# EAGLE design HMS_Olfactometer_v2.0 (EAGLE 9.0.1)

## Sheet 1 of 2
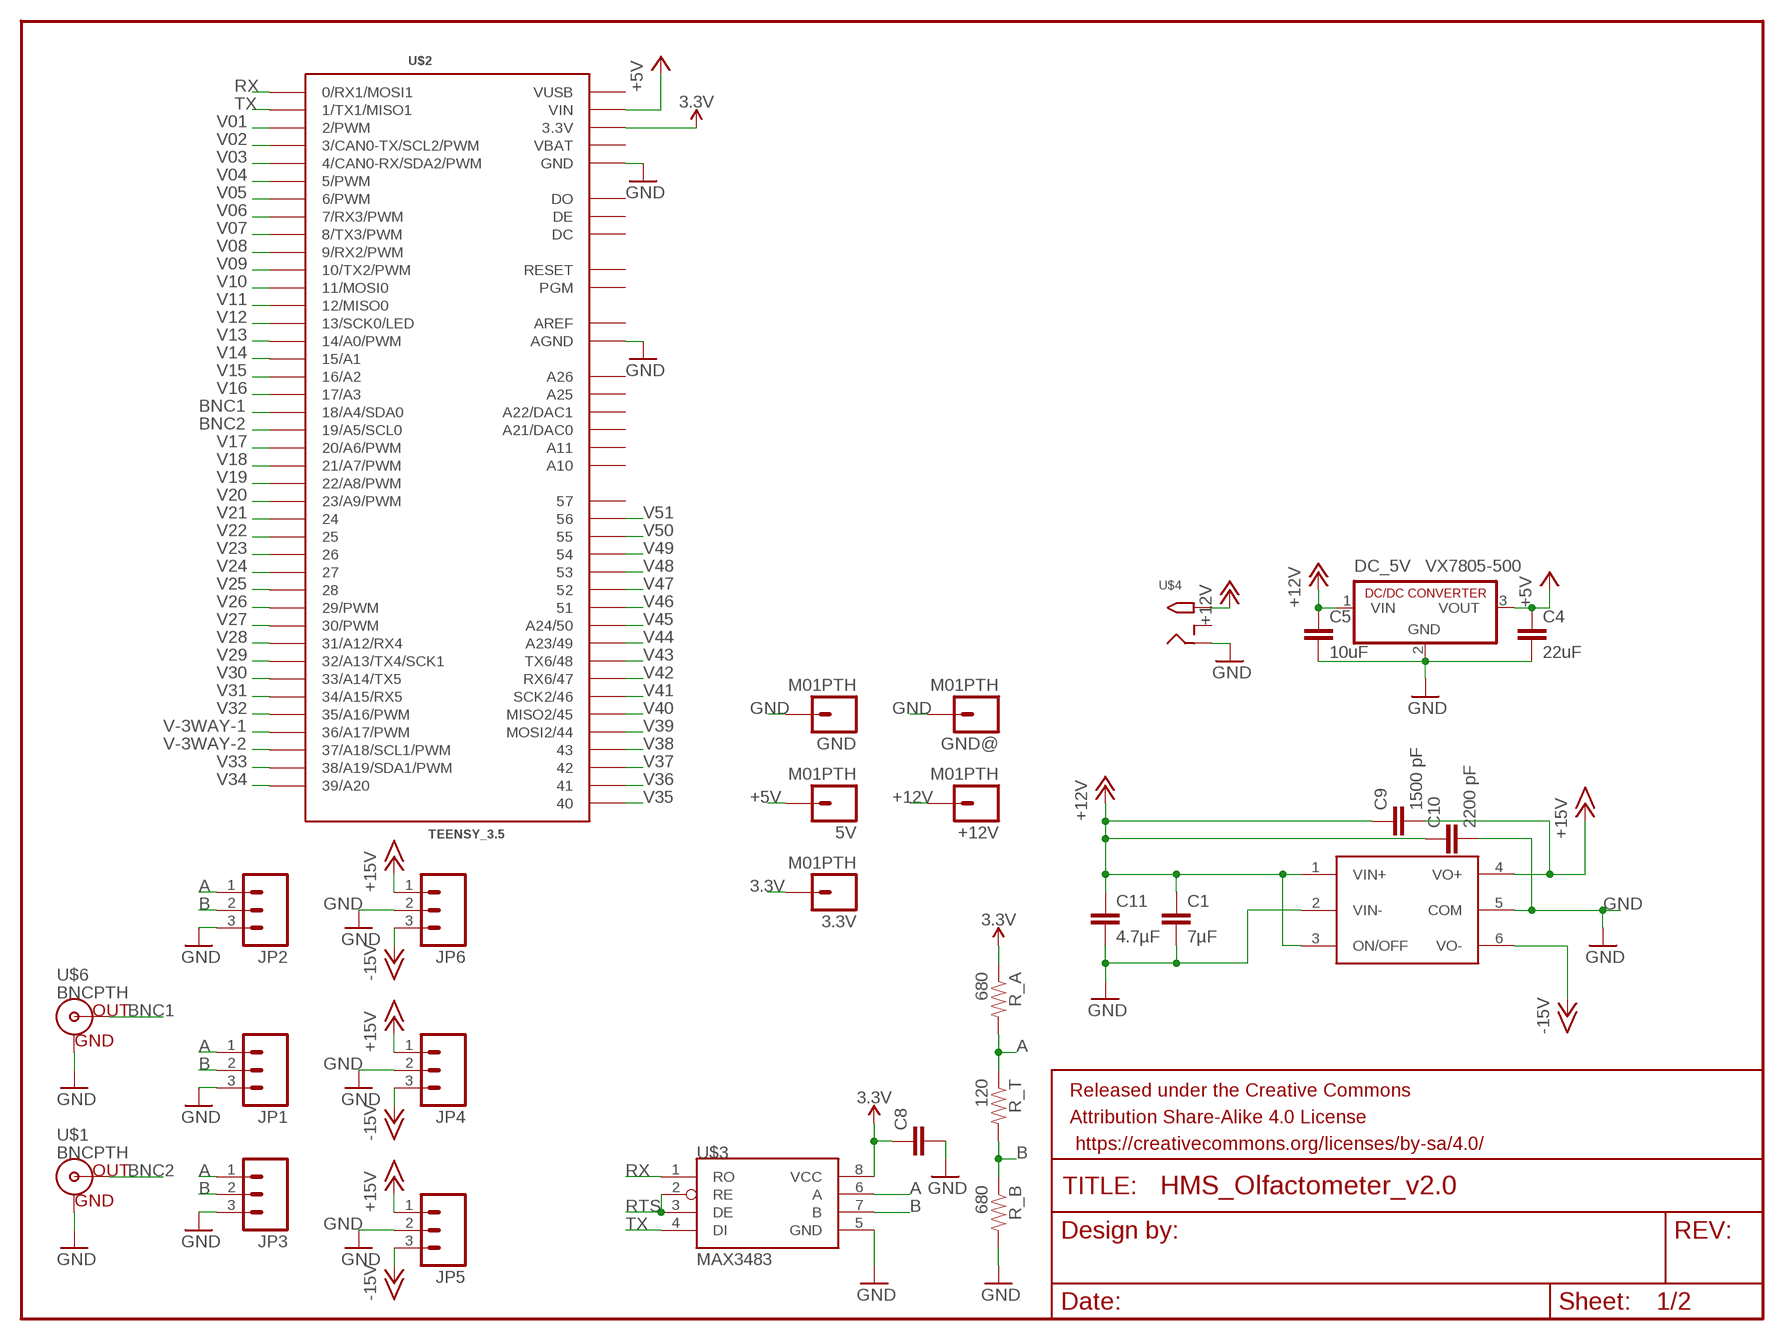
[diagram p0: schematic, sheet 1]

### Parts
3.3V  M01PTH  [1X01]
5V  M01PTH  [1X01]
+12V  M01PTH  [1X01]
C1  7µF  C-EUC1812  [C1812]
C4  22uF  10UF-6.3V-20%(1206)  [1206]
C5  10uF  CAP1206  [1206]
C8  CAP1206  [1206]
C9  1500 pF  C-EUC1206  [C1206]
C10  2200 pF  C-EUC1206  [C1206]
C11  4.7µF  C-EUC1812  [C1812]
DC_5V  VX7805-500  R-78C12-1.0  [SIP3]
DC_+/-15V  XPPOWER_+/-15V_60W_DC-DC_SUPPLY  [XPPOWER_60W_JTL60_DC_DC_POWER_SUPPLY]
FRAME1  FRAME-LETTER  [CREATIVE_COMMONS]
GND  M01PTH  [1X01]
GND@  M01PTH  [1X01]
JP1  M03POLAR  [MOLEX-1X3]
JP2  M03POLAR  [MOLEX-1X3]
JP3  M03POLAR  [MOLEX-1X3]
JP4  M03SCREW  [SCREWTERMINAL-3.5MM-3]
JP5  M03SCREW  [SCREWTERMINAL-3.5MM-3]
JP6  M03SCREW  [SCREWTERMINAL-3.5MM-3]
R_A  680  RESISTORPTH-1/2W  [AXIAL-0.5]
R_B  680  RESISTORPTH-1/2W  [AXIAL-0.5]
R_T  120  RESISTORPTH-1/2W  [AXIAL-0.5]
U$1  BNCPTH  [BNC]
U$2  TEENSY_3.5  TEENSY_3.5_ALL_PINS&PADS  [TEENSY_3.5_ALL_PINS&PADS]
U$3  MAX3483  MAX485DIL  [DIL08]
U$4  2.1MMJACKTHM  [PJ-102A]
U$6  BNCPTH  [BNC]

### Nets
3.3V [power]: 3.3V.1 C8.1 R_A.P$1 U$2.3.3V U$2.3.3V2(3.3V) U$2.3.3V3(3.3V) U$2.3.3V4(3.3V) U$3.8(VCC)
+5V [power]: 5V.1 C4.1 DC_5V.3(VOUT) U$2.VIN
+12V [power]: +12V.1 C1.1 C5.1 C9.1 C10.1 C11.1 DC_5V.1(VIN) DC_+/-15V.1(VIN+) DC_+/-15V.3(ON/OFF) U$4.TIP ; also sheet 2
+15V: C9.2 DC_+/-15V.4(VO+) JP4.1 JP5.1 JP6.1
-15V: DC_+/-15V.6(VO-) JP4.3 JP5.3 JP6.3
A: JP1.1 JP2.1 JP3.1 R_A.P$2 R_T.P$1 U$3.6(A)
B: JP1.2 JP2.2 JP3.2 R_B.P$1 R_T.P$2 U$3.7(B)
BNC1: U$2.18/A4(18/A4/SDA0) U$6.S(OUT)
BNC2: U$1.S(OUT) U$2.19/A5(19/A5/SCL0)
GND: C1.2 C4.2 C5.2 C8.2 C10.2 C11.2 DC_5V.2(GND) DC_+/-15V.2(VIN-) DC_+/-15V.5(COM) GND.1 GND@.1 JP1.3 JP2.3 JP3.3 JP4.2 JP5.2 JP6.2 R_B.P$2 U$1.GND U$2.AGND U$2.GND U$2.GND1(GND) U$2.GND2(GND) U$2.GND3(GND) U$2.GND4(GND) U$2.GND5(GND) U$2.GND6(GND) U$3.5(GND) U$4.RING U$6.GND ; also sheet 2
RTS: U$3.2(RE) U$3.3(DE)
RX: U$2.0(0/RX1/MOSI1) U$3.1(RO)
TX: U$2.1(1/TX1/MISO1) U$3.4(DI)
V01: U$2.2(2/PWM) ; also sheet 2
V02: U$2.3(3/CAN0-TX/SCL2/PWM) ; also sheet 2
V03: U$2.4(4/CAN0-RX/SDA2/PWM) ; also sheet 2
V04: U$2.5(5/PWM) ; also sheet 2
V05: U$2.6(6/PWM) ; also sheet 2
V06: U$2.7(7/RX3/PWM) ; also sheet 2
V07: U$2.8(8/TX3/PWM) ; also sheet 2
V08: U$2.9(9/RX2/PWM) ; also sheet 2
V09: U$2.10(10/TX2/PWM) ; also sheet 2
V10: U$2.11(11/MOSI0) ; also sheet 2
V11: U$2.12(12/MISO0) ; also sheet 2
V12: U$2.13(13/SCK0/LED) ; also sheet 2
V13: U$2.14/A0(14/A0/PWM) ; also sheet 2
V14: U$2.15/A1 ; also sheet 2
V15: U$2.16/A2 ; also sheet 2
V16: U$2.17/A3 ; also sheet 2
V17: U$2.20/A6(20/A6/PWM) ; also sheet 2
V18: U$2.21/A7(21/A7/PWM) ; also sheet 2
V19: U$2.22/A8(22/A8/PWM) ; also sheet 2
V20: U$2.23/A9(23/A9/PWM) ; also sheet 2
V21: U$2.24 ; also sheet 2
V22: U$2.25 ; also sheet 2
V23: U$2.26 ; also sheet 2
V24: U$2.27 ; also sheet 2
V25: U$2.28 ; also sheet 2
V26: U$2.29(29/PWM) ; also sheet 2
V27: U$2.30(30/PWM) ; also sheet 2
V28: U$2.31/A12(31/A12/RX4) ; also sheet 2
V29: U$2.32/A13(32/A13/TX4/SCK1) ; also sheet 2
V30: U$2.33/A14(33/A14/TX5) ; also sheet 2
V31: U$2.34/A15(34/A15/RX5) ; also sheet 2
V32: U$2.35/A16(35/A16/PWM) ; also sheet 2
V33: U$2.38/A19(38/A19/SDA1/PWM) ; also sheet 2
V34: U$2.39/A20 ; also sheet 2
V35: U$2.40 ; also sheet 2
V36: U$2.41 ; also sheet 2
V37: U$2.42 ; also sheet 2
V38: U$2.43 ; also sheet 2
V39: U$2.44(MOSI2/44) ; also sheet 2
V40: U$2.45(MISO2/45) ; also sheet 2
V41: U$2.46(SCK2/46) ; also sheet 2
V42: U$2.47(RX6/47) ; also sheet 2
V43: U$2.48(TX6/48) ; also sheet 2
V44: U$2.49(A23/49) ; also sheet 2
V45: U$2.50(A24/50) ; also sheet 2
V46: U$2.51 ; also sheet 2
V47: U$2.52 ; also sheet 2
V48: U$2.53 ; also sheet 2
V49: U$2.54 ; also sheet 2
V50: U$2.55 ; also sheet 2
V51: U$2.56 ; also sheet 2
V-3WAY-1: U$2.36/A17(36/A17/PWM) ; also sheet 2
V-3WAY-2: U$2.37/A18(37/A18/SCL1/PWM) ; also sheet 2
Unconnected: U$2.57 U$2.A10 U$2.A11 U$2.A21(A21/DAC0) U$2.A22(A22/DAC1) U$2.A25 U$2.A26 U$2.DC U$2.DE U$2.DO U$2.PGM U$2.RESET U$4.RING_SW

## Sheet 2 of 2
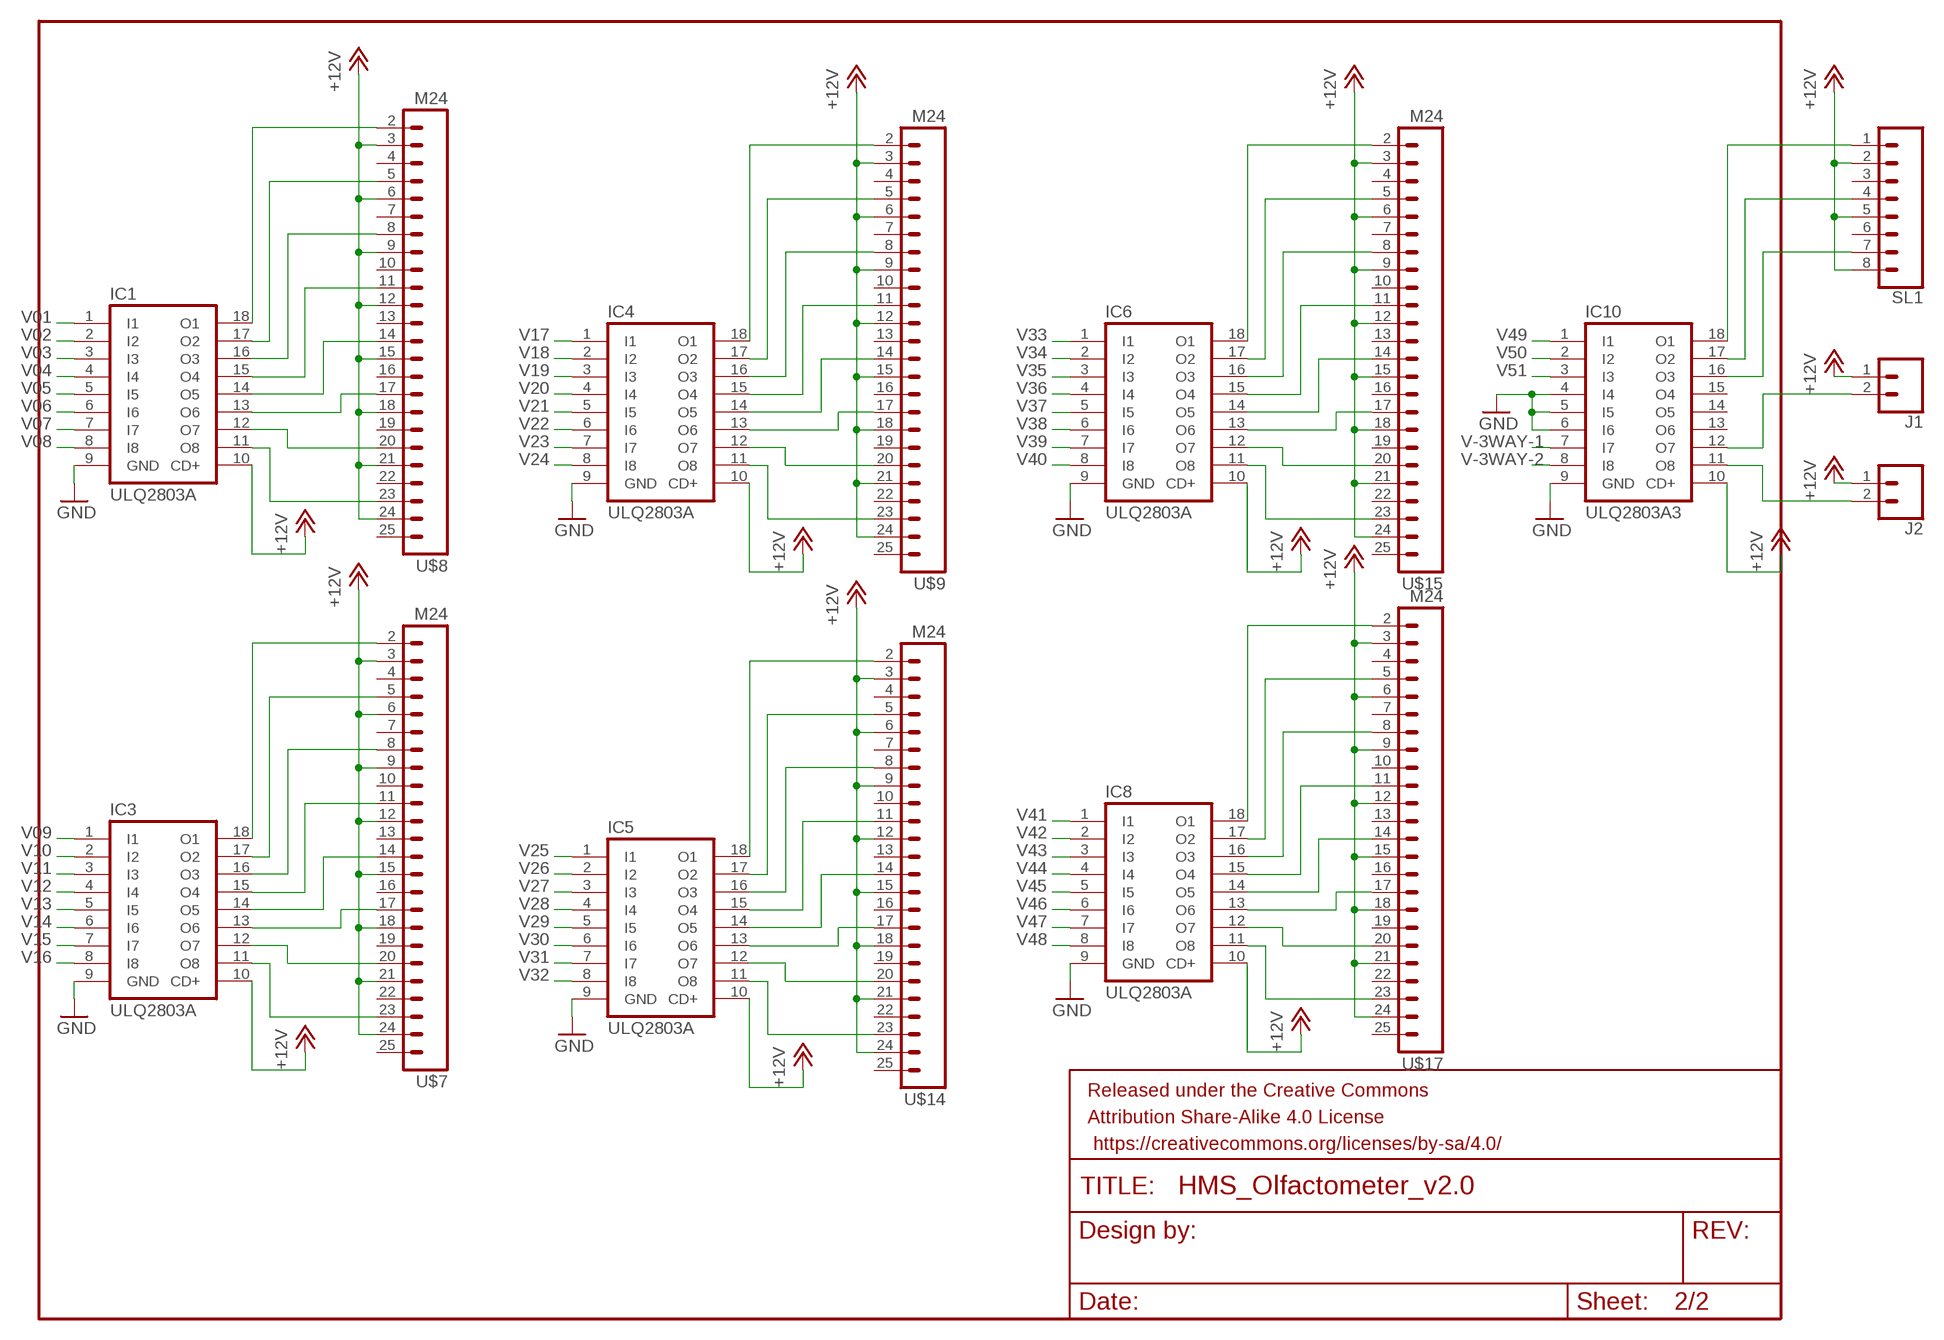
[diagram p1: schematic, sheet 2]

### Parts
FRAME2  FRAME-LETTER  [CREATIVE_COMMONS]
IC1  ULQ2803A  ULN2803A  [DIL18]
IC3  ULQ2803A  ULN2803A  [DIL18]
IC4  ULQ2803A  ULN2803A  [DIL18]
IC5  ULQ2803A  ULN2803A  [DIL18]
IC6  ULQ2803A  ULN2803A  [DIL18]
IC8  ULQ2803A  ULN2803A  [DIL18]
IC10  ULQ2803A3  ULN2803A  [DIL18]
J1  CONN_02  [1X02]
J2  CONN_02  [1X02]
SL1  CONN_08"  [1X08]
U$7  M24  [1X24]
U$8  M24  [1X24]
U$9  M24  [1X24]
U$14  M24  [1X24]
U$15  M24  [1X24]
U$17  M24  [1X24]

### Nets
+12V [power]: IC1.10(CD+) IC3.10(CD+) IC4.10(CD+) IC5.10(CD+) IC6.10(CD+) IC8.10(CD+) IC10.10(CD+) J1.1 J2.1 SL1.2 SL1.5 SL1.8 U$7.3 U$7.6 U$7.9 U$7.12 U$7.15 U$7.18 U$7.21 U$7.24 U$8.3 U$8.6 U$8.9 U$8.12 U$8.15 U$8.18 U$8.21 U$8.24 U$9.3 U$9.6 U$9.9 U$9.12 U$9.15 U$9.18 U$9.21 U$9.24 U$14.3 U$14.6 U$14.9 U$14.12 U$14.15 U$14.18 U$14.21 U$14.24 U$15.3 U$15.6 U$15.9 U$15.12 U$15.15 U$15.18 U$15.21 U$15.24 U$17.3 U$17.6 U$17.9 U$17.12 U$17.15 U$17.18 U$17.21 U$17.24 ; also sheet 1
GND: IC1.9(GND) IC3.9(GND) IC4.9(GND) IC5.9(GND) IC6.9(GND) IC8.9(GND) IC10.4(I4) IC10.5(I5) IC10.6(I6) IC10.9(GND) ; also sheet 1
N$2: IC1.18(O1) U$8.2
N$3: IC1.17(O2) U$8.5
N$4: IC1.16(O3) U$8.8
N$5: IC1.15(O4) U$8.11
N$6: IC1.14(O5) U$8.14
N$7: IC1.13(O6) U$8.17
N$8: IC1.12(O7) U$8.20
N$9: IC1.11(O8) U$8.23
N$17: IC3.11(O8) U$7.23
N$18: IC3.12(O7) U$7.20
N$19: IC3.13(O6) U$7.17
N$20: IC3.14(O5) U$7.14
N$21: IC3.15(O4) U$7.11
N$22: IC3.16(O3) U$7.8
N$23: IC3.17(O2) U$7.5
N$24: IC3.18(O1) U$7.2
N$25: IC4.11(O8) U$9.23
N$26: IC4.12(O7) U$9.20
N$27: IC4.13(O6) U$9.17
N$28: IC4.14(O5) U$9.14
N$29: IC4.15(O4) U$9.11
N$30: IC4.16(O3) U$9.8
N$31: IC4.17(O2) U$9.5
N$32: IC4.18(O1) U$9.2
N$33: IC5.11(O8) U$14.23
N$34: IC5.12(O7) U$14.20
N$35: IC5.13(O6) U$14.17
N$36: IC5.14(O5) U$14.14
N$37: IC5.15(O4) U$14.11
N$38: IC5.16(O3) U$14.8
N$39: IC5.17(O2) U$14.5
N$40: IC5.18(O1) U$14.2
N$51: IC6.11(O8) U$15.23
N$52: IC6.12(O7) U$15.20
N$61: IC6.13(O6) U$15.17
N$63: IC6.14(O5) U$15.14
N$64: IC6.15(O4) U$15.11
N$65: IC6.16(O3) U$15.8
N$66: IC6.17(O2) U$15.5
N$67: IC6.18(O1) U$15.2
N$76: IC8.11(O8) U$17.23
N$77: IC8.12(O7) U$17.20
N$78: IC8.13(O6) U$17.17
N$79: IC8.14(O5) U$17.14
N$80: IC8.15(O4) U$17.11
N$81: IC8.16(O3) U$17.8
N$82: IC8.17(O2) U$17.5
N$83: IC8.18(O1) U$17.2
N$92: IC10.11(O8) J2.2
N$93: IC10.12(O7) J1.2
N$97: IC10.16(O3) SL1.7
N$98: IC10.17(O2) SL1.4
N$99: IC10.18(O1) SL1.1
V01: IC1.1(I1) ; also sheet 1
V02: IC1.2(I2) ; also sheet 1
V03: IC1.3(I3) ; also sheet 1
V04: IC1.4(I4) ; also sheet 1
V05: IC1.5(I5) ; also sheet 1
V06: IC1.6(I6) ; also sheet 1
V07: IC1.7(I7) ; also sheet 1
V08: IC1.8(I8) ; also sheet 1
V09: IC3.1(I1) ; also sheet 1
V10: IC3.2(I2) ; also sheet 1
V11: IC3.3(I3) ; also sheet 1
V12: IC3.4(I4) ; also sheet 1
V13: IC3.5(I5) ; also sheet 1
V14: IC3.6(I6) ; also sheet 1
V15: IC3.7(I7) ; also sheet 1
V16: IC3.8(I8) ; also sheet 1
V17: IC4.1(I1) ; also sheet 1
V18: IC4.2(I2) ; also sheet 1
V19: IC4.3(I3) ; also sheet 1
V20: IC4.4(I4) ; also sheet 1
V21: IC4.5(I5) ; also sheet 1
V22: IC4.6(I6) ; also sheet 1
V23: IC4.7(I7) ; also sheet 1
V24: IC4.8(I8) ; also sheet 1
V25: IC5.1(I1) ; also sheet 1
V26: IC5.2(I2) ; also sheet 1
V27: IC5.3(I3) ; also sheet 1
V28: IC5.4(I4) ; also sheet 1
V29: IC5.5(I5) ; also sheet 1
V30: IC5.6(I6) ; also sheet 1
V31: IC5.7(I7) ; also sheet 1
V32: IC5.8(I8) ; also sheet 1
V33: IC6.1(I1) ; also sheet 1
V34: IC6.2(I2) ; also sheet 1
V35: IC6.3(I3) ; also sheet 1
V36: IC6.4(I4) ; also sheet 1
V37: IC6.5(I5) ; also sheet 1
V38: IC6.6(I6) ; also sheet 1
V39: IC6.7(I7) ; also sheet 1
V40: IC6.8(I8) ; also sheet 1
V41: IC8.1(I1) ; also sheet 1
V42: IC8.2(I2) ; also sheet 1
V43: IC8.3(I3) ; also sheet 1
V44: IC8.4(I4) ; also sheet 1
V45: IC8.5(I5) ; also sheet 1
V46: IC8.6(I6) ; also sheet 1
V47: IC8.7(I7) ; also sheet 1
V48: IC8.8(I8) ; also sheet 1
V49: IC10.1(I1) ; also sheet 1
V50: IC10.2(I2) ; also sheet 1
V51: IC10.3(I3) ; also sheet 1
V-3WAY-1: IC10.7(I7) ; also sheet 1
V-3WAY-2: IC10.8(I8) ; also sheet 1
Unconnected: IC10.13(O6) IC10.14(O5) IC10.15(O4) SL1.3 SL1.6 U$7.4 U$7.7 U$7.10 U$7.13 U$7.16 U$7.19 U$7.22 U$7.25 U$8.4 U$8.7 U$8.10 U$8.13 U$8.16 U$8.19 U$8.22 U$8.25 U$9.4 U$9.7 U$9.10 U$9.13 U$9.16 U$9.19 U$9.22 U$9.25 U$14.4 U$14.7 U$14.10 U$14.13 U$14.16 U$14.19 U$14.22 U$14.25 U$15.4 U$15.7 U$15.10 U$15.13 U$15.16 U$15.19 U$15.22 U$15.25 U$17.4 U$17.7 U$17.10 U$17.13 U$17.16 U$17.19 U$17.22 U$17.25

## Power pins joined to a net without a drawn wire
AREF: U$2.AREF
VBAT: U$2.VBAT
VUSB: U$2.VUSB

## Library data of the parts
3.3V 5V +12V GND GND@ = SparkFun-Connectors:M01: Header 1 Standard 1-pin 0.1" header. Use with straight break away headers (SKU : PRT-00116), right angle break away headers (PRT-00553), swiss pins (PRT-00743), machine pins (PRT-00117), and female headers (PRT-00115).
C1 C9-C11 = rcl:C-EU: CAPACITOR, European symbol; SPICEPREFIX: C
C4 = SparkFun-Capacitors:10UF-6.3V-20%(1206): Ceramic CAP-10057; PROD_ID: CAP-10057; VALUE: 10uF
C5 C8 = SparkFun-Capacitors:CAP: Capacitor Standard 0603 ceramic capacitor, and 0.1" leaded capacitor.
DC_5V = dc-dc-converter:R-78C*-1.0: INNOLINE DC/DC-Converter 1.0 AMP SIP3 Single Output Source: Data sheet <http://www.mikrocontroller.net/attachment/150645/157764-da-01-en-DC_DC_WANDLER_R_78C5_0_1_0.pdf>
DC_+/-15V = ofer-eagle-lib:XPPOWER_+/-15V_60W_DC-DC_SUPPLY
FRAME1 FRAME2 = SparkFun-Aesthetics:FRAME-LETTER: Schematic Frame - Letter Standard 8.5x11 US Letter frame
IC1 IC3-IC6 IC8 IC10 = uln-udn:ULN2803A: DRIVER ARRAY
J1 J2 = SparkFun-Connectors:CONN_02: Multi connection point. Often used as Generic Header-pin footprint for 0.1 inch spaced/style header connections On any of the 0.1 inch spaced packages, you can populate with these: Break Away Headers - Straight <https://www.sparkfun.com/products/116> (PRT-00116) Break Away Male Headers - Right Angle <https://www.sparkfun.com/products/553> (PRT-00553) Female Headers <https://www.sparkfun.com/products/115> (PRT-00115) Break Away Headers - Machine Pin <https://www.sparkfun.com/products/117> (PRT-00117) Break Away Female Headers - Swiss Machine Pin <https://www.sparkfun.com/products/743> (PRT-00743) For SCREWTERMINALS and SPRING TERMINALS visit here: Screw Terimnals on SparkFun.com <https://www.sparkfun.com/search/results?term=Screw+Terminals> (5mm/3.5mm/2.54mm spacing) This device is also useful as a general connection point to wire up your design to another part of your project. Our various solder wires solder well into these plated through hole pads. Hook-Up Wire - Assortment (Stranded, 22 AWG) <https://www.sparkfun.com/products/11375> (PRT-11375) Hook-Up Wire - Assortment (Solid Core, 22 AWG) <https://www.sparkfun.com/products/11367> (PRT-11367) View the entire wire category on our website here <https://www.sparkfun.com/categories/141> Special notes: Molex polarized connector foot print use with: PRT-08233 with associated crimp pins and housings. 2.54_SCREWTERM for use with PRT-10571. 3.5mm Screw Terminal footprints for PRT-08084 5mm Screw Terminal footprints for use with PRT-08432
JP1-JP6 = SparkFun-Connectors:M03: Header 3 Standard 3-pin 0.1" header. Use with straight break away headers (SKU : PRT-00116), right angle break away headers (PRT-00553), swiss pins (PRT-00743), machine pins (PRT-00117), and female headers (PRT-00115). Molex polarized connector foot print use with SKU : PRT-08232 with associated crimp pins and housings.
R_A R_B R_T = SparkFun-Resistors:RESISTOR: Resistor Basic schematic elements and footprints for 0603, 1206, and PTH resistors.
SL1 = SparkFun-Connectors:CONN_08: Multi connection point. Often used as Generic Header-pin footprint for 0.1 inch spaced/style header connections On any of the 0.1 inch spaced packages, you can populate with these: Break Away Headers - Straight <https://www.sparkfun.com/products/116> (PRT-00116) Break Away Male Headers - Right Angle <https://www.sparkfun.com/products/553> (PRT-00553) Female Headers <https://www.sparkfun.com/products/115> (PRT-00115) Break Away Headers - Machine Pin <https://www.sparkfun.com/products/117> (PRT-00117) Break Away Female Headers - Swiss Machine Pin <https://www.sparkfun.com/products/743> (PRT-00743) Arduino Stackable Header - 8 Pin <https://www.sparkfun.com/products/9279> (PRT-09279) For SCREWTERMINALS and SPRING TERMINALS visit here: Screw Terimnals on SparkFun.com <https://www.sparkfun.com/search/results?term=Screw+Terminals> (5mm/3.5mm/2.54mm spacing) This device is also useful as a general connection point to wire up your design to another part of your project. Our various solder wires solder well into these plated through hole pads. Hook-Up Wire - Assortment (Stranded, 22 AWG) <https://www.sparkfun.com/products/11375> (PRT-11375) Hook-Up Wire - Assortment (Solid Core, 22 AWG) <https://www.sparkfun.com/products/11367> (PRT-11367) View the entire wire category on our website here <https://www.sparkfun.com/categories/141> Special notes: Molex polarized connector foot print use with SKU : PRT-08231 with associated crimp pins and housings. 1MM SMD Version SKU: PRT-10208 NOTES ON THE VARIANTS LOCK and LOCK_LONGPADS... This footprint was designed to help hold the alignment of a through-hole component (i.e. 6-pin header) while soldering it into place. You may notice that each hole has been shifted either up or down by 0.005 of an inch from it's more standard position (which is a perfectly straight line). This slight alteration caused the pins (the squares in the middle) to touch the edges of the holes. Because they are alternating, it causes a "brace" to hold the component in place. 0.005 has proven to be the perfect amount of "off-center" position when using our standard breakaway headers. Although looks a little odd when you look at the bare footprint, once you have a header in there, the alteration is very hard to notice. Also,if you push a header all the way into place, it is covered up entirely on the bottom side.; PROD_ID: CONN-08438
U$1 U$6 = SparkFun-Connectors:BNC: BNC Connector, Mouser Part# 5227161
U$2 = Teensy_3_and_LC_Series_Boards_v1.4:TEENSY_3.5_ALL_PINS&PADS: All pins and pads on the Teensy 3.5 exposed. Assumes the use of multiple, unshrouded headers to get access to the pads on the underside of the Teensy These headers should be a 2x5, 2x4, and a 2x3 with a 0.1" hole spacing / pitch.
U$3 = SparkFun-DigitalIC:MAX485: RS-485 transceiver; SPICEPREFIX: X
U$4 = adafruit:2.1MMJACK: 2.1mm x 5.5mm THM DC jack with internal switch. Digikey part #PJ-102A, 4UCON part #05537 2.1mm x 5.5mm SMT DC jack with internal switch. Digikey part #PJ-002A-SMT, 4UCON part #03267 By microbuilder.eu & adafruit.com
U$7-U$9 U$14 U$15 U$17 = SparkFun-Connectors:M24: 1x24 .1" header

## Net classes
0 default: width 0.203 mm, clearance 0.203 mm
1 power: width 0.61 mm, clearance 0.254 mm

## Board
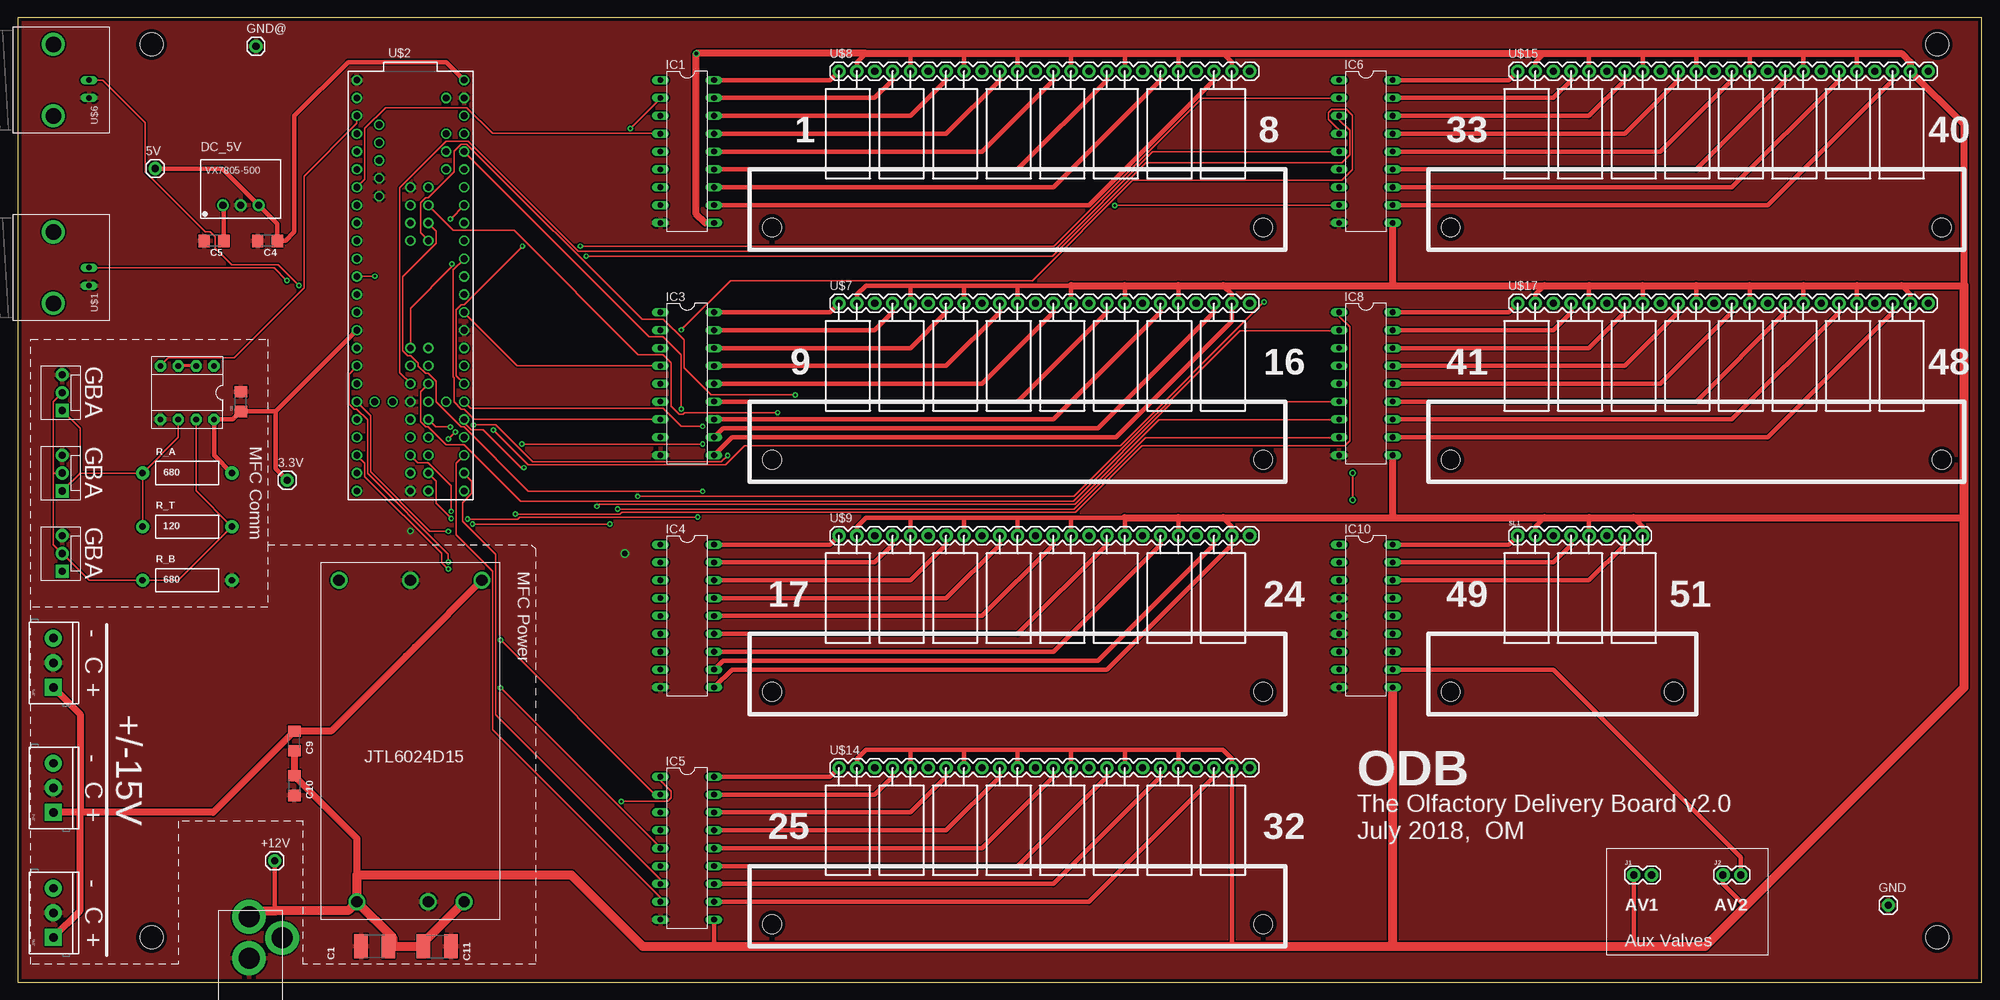
[diagram p2: board, top side]
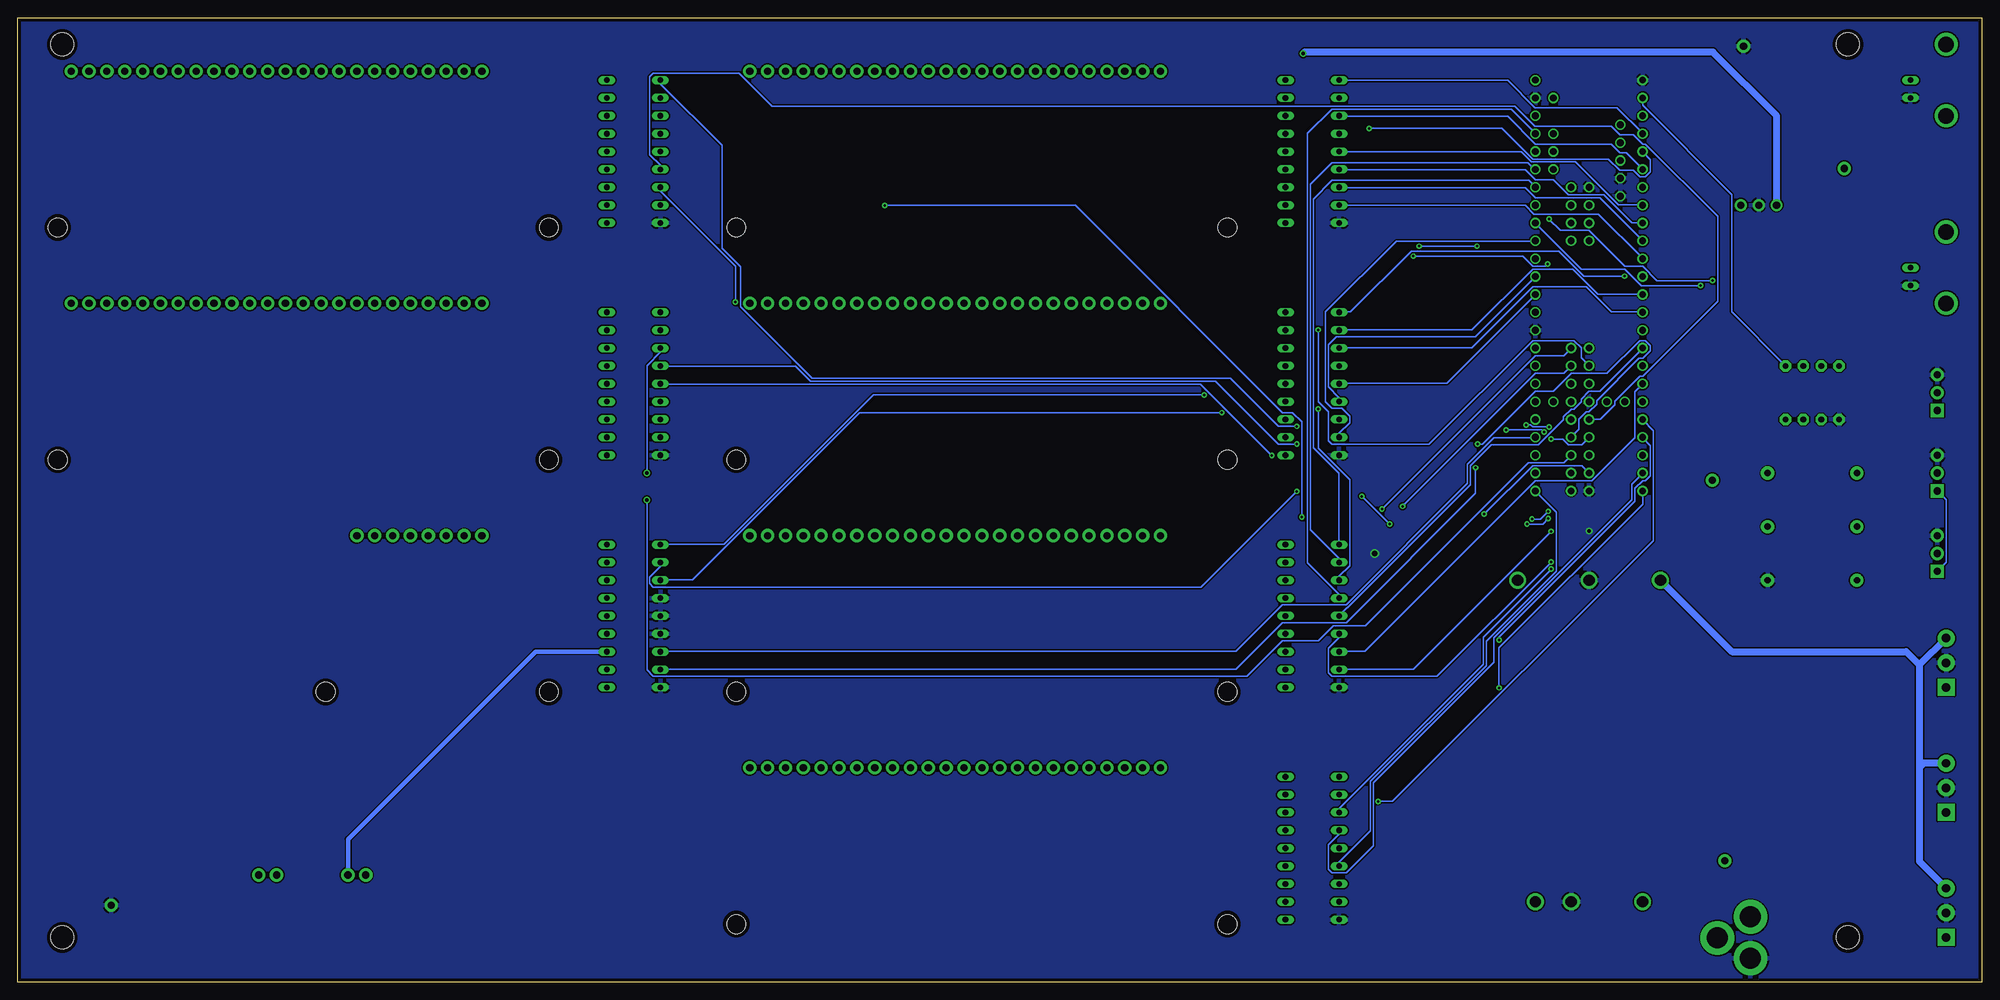
[diagram p3: board, bottom side, seen from below]

Size 279.4 x 137.16 mm. Coordinates in mm from the lower left corner, seen from the top.
Outline: 0,0 279.4,0 279.4,137.16 0,137.16 0,0
Copper layers (1*16): Top 0.0178mm / dielectric 59mil / Bottom 0.0178mm
Design rules "SSC-EAGLE-2Lyr_v1.0.0.3 *": minimum track width 6mil, minimum drill 14mil, track to track 6mil, track to pad 6mil, pad to pad 6mil, via to via 6mil, smd to smd 6mil, copper to edge 20mil, drill to drill 16mil, minimum pad ring 8mil, minimum via ring 8mil, stop-mask expansion 3mil, vias tented up to drill 0mil, thermal gap 10mil
Holes 2.72 mm at 177.16,107.31 107.31,107.31 177.16,74.3 107.31,74.3 177.16,41.27 107.31,41.27 177.16,8.26 107.31,8.26 273.69,107.31 203.84,107.31 273.69,74.3 203.84,74.3 235.59,41.27 203.84,41.27

### Footprints (pad centres in the part's own frame; a part is rotated, then mirrored left to right if it is on the bottom)
1X01 = drill 1.016 pad 1.88: 1 0,0
C1812 = smd 1.9 x 3.4: 1 -1.95,0; 2 1.95,0
1206 = smd 1.6 x 1.8: 1 -1.4,0; 2 1.4,0
C1206 = smd 1.6 x 1.8: 1 -1.4,0; 2 1.4,0
SIP3 = drill 1 pad 1.676: 1 -2.54,0; 2 0,0; 3 2.54,0
XPPOWER_60W_JTL60_DC_DC_POWER_SUPPLY = drill 1.6: 1 -22.86,-7.62; 2 -22.86,-2.54; 3 -22.86,7.62; 4 22.86,-10.16; 5 22.86,0; 6 22.86,10.16
DIL18 = drill 0.813 long: 1 -10.16,-3.81; 2 -7.62,-3.81; 3 -5.08,-3.81; 4 -2.54,-3.81; 5 0,-3.81; 6 2.54,-3.81; 7 5.08,-3.81; 8 7.62,-3.81; 9 10.16,-3.81; 10 10.16,3.81; 11 7.62,3.81; 12 5.08,3.81; 13 2.54,3.81; 14 0,3.81; 15 -2.54,3.81; 16 -5.08,3.81; 17 -7.62,3.81; 18 -10.16,3.81
1X02 = drill 1.016 pad 1.88: 1 0,0; 2 2.54,0
MOLEX-1X3 = drill 1.016 pad 1.88 square: 1 0,0 | drill 1.016 pad 1.88: 2 2.54,0; 3 5.08,0
SCREWTERMINAL-3.5MM-3 = drill 1.2 pad 2.413 square: 1 0,0 | drill 1.2 pad 2.413: 2 3.5,0; 3 7,0
AXIAL-0.5 = drill 0.9 pad 1.88: P$1 -6.35,0; P$2 6.35,0
1X08 = drill 1.016 pad 1.88: 1 0,0; 2 2.54,0; 3 5.08,0; 4 7.62,0; 5 10.16,0; 6 12.7,0; 7 15.24,0; 8 17.78,0
BNC = drill 2.2: 3 -5.08,5.08; 4 5.08,5.08 | drill 0.8 long: GND -2.54,0; S 0,0
TEENSY_3.5_ALL_PINS&PADS = drill 0.965: 0 -7.62,13.97; 1 -7.62,11.43; 2 -7.62,8.89; 3 -7.62,6.35; 3.3V 7.62,11.43; 3.3V2 2.54,-41.91; 3.3V3 -7.62,-19.05; 3.3V4 -2.54,-29.21; 4 -7.62,3.81; 5 -7.62,1.27; 6 -7.62,-1.27; 7 -7.62,-3.81; 8 -7.62,-6.35; 9 -7.62,-8.89; 10 -7.62,-11.43; 11 -7.62,-13.97; 12 -7.62,-16.51; 13 7.62,-16.51; 14/A0 7.62,-13.97; 15/A1 7.62,-11.43; 16/A2 7.62,-8.89; 17/A3 7.62,-6.35; 18/A4 7.62,-3.81; 19/A5 7.62,-1.27; 20/A6 7.62,1.27; 21/A7 7.62,3.81; 22/A8 7.62,6.35; 23/A9 7.62,8.89; 24 -7.62,-21.59; 25 -7.62,-24.13; 26 -7.62,-26.67; 27 -7.62,-29.21; 28 -7.62,-31.75; 29 -7.62,-34.29; 30 -7.62,-36.83; 31/A12 -7.62,-39.37; 32/A13 -7.62,-41.91; 33/A14 7.62,-41.91; 34/A15 7.62,-39.37; 35/A16 7.62,-36.83; 36/A17 7.62,-34.29; 37/A18 7.62,-31.75; 38/A19 7.62,-29.21; 39/A20 7.62,-26.67; 40 0,-21.59; 41 0,-24.13; 42 0,-26.67; 43 0,-31.75; 44 0,-34.29; 45 0,-36.83; 46 0,-39.37; 47 2.54,-39.37; 48 2.54,-36.83; 49 2.54,-34.29; 50 2.54,-31.75; 51 2.54,-26.67; 52 2.54,-24.13; 53 2.54,-21.59; 54 2.54,-6.35; 55 2.54,-3.81; 56 2.54,-1.27; 57 2.54,1.27; A10 5.08,6.35; A11 5.08,3.81; A21 7.62,-24.13; A22 7.62,-21.59; A25 -4.445,5.08; A26 -4.445,7.62; AGND 7.62,13.97; AREF 5.08,8.89; DC 0,-3.81; DE 0,-1.27; DO 0,-6.35; GND -7.62,16.51; GND1 7.62,-19.05; GND2 0,1.27; GND3 -4.445,2.54; GND4 -4.445,0; GND5 0,-41.91; GND6 0,-29.21; NC -4.445,10.16; PGM 2.54,-29.21; RESET 5.08,-29.21; VBAT -5.08,-29.21; VIN 7.62,16.51; VUSB 5.08,13.97
DIL08 = drill 0.813 pad 1.6 octagon: 1 -3.81,-3.81; 2 -1.27,-3.81; 3 1.27,-3.81; 4 3.81,-3.81; 5 3.81,3.81; 6 1.27,3.81; 7 -1.27,3.81; 8 -3.81,3.81
PJ-102A = drill 3 pad 4.8: RING 0.1,-3.39; RING_SW -4.6,-6.29; TIP 0.1,-9.29
1X24 = drill 1.016 pad 1.88: 2 -26.67,0; 3 -24.13,0; 4 -21.59,0; 5 -19.05,0; 6 -16.51,0; 7 -13.97,0; 8 -11.43,0; 9 -8.89,0; 10 -6.35,0; 11 -3.81,0; 12 -1.27,0; 13 1.27,0; 14 3.81,0; 15 6.35,0; 16 8.89,0; 17 11.43,0; 18 13.97,0; 19 16.51,0; 20 19.05,0; 21 21.59,0; 22 24.13,0; 23 26.67,0; 24 29.21,0; 25 31.75,0
STAND-OFF = hole 3.302: 0,0

### Placement (x,y rotation side)
3.3V  38.35,71.37 0 top
5V  19.56,115.7 0 top
+12V  36.58,17.27 0 top
C1  50.8,5.08 180 top
C4  35.56,105.41 180 top
C5  27.94,105.41 180 top
C8  31.75,82.55 90 top
C9  39.37,34.29 90 top
C10  39.37,27.94 270 top
C11  59.69,5.08 0 top
DC_5V  31.75,110.49 0 top
DC_+/-15V  55.88,34.29 90 top
FRAME1  22.61,-11.94 0 top  (outside the outline)
FRAME2  22.61,-11.81 0 top  (outside the outline)
GND  266.06,10.92 0 top
GND@  33.91,133.1 0 top
IC1  95.25,118.11 270 top
IC3  95.25,85.09 270 top
IC4  95.25,52.07 270 top
IC5  95.25,19.05 270 top
IC6  191.77,118.11 270 top
IC8  191.77,85.09 270 top
IC10  191.77,52.07 270 top
J1  229.87,15.24 0 top
J2  242.57,15.24 0 top
JP1  6.35,69.85 90 top
JP2  6.35,81.28 90 top
JP3  6.35,58.42 90 top
JP4  5.08,24.13 90 top
JP5  5.08,41.91 90 top
JP6  5.08,6.35 90 top
R_A  24.13,72.39 180 top
R_B  24.13,57.15 0 top
R_T  24.13,64.77 0 top
SL1  213.36,63.5 0 top
U$1  10.16,101.6 90 top
U$2  55.88,111.76 0 top
U$3  24.13,83.82 180 top
U$4  33.02,0 180 top
U$6  10.16,128.27 90 top
U$7  143.51,96.52 0 top
U$8  143.51,129.54 0 top
U$9  143.51,63.5 0 top
U$10  [STAND-OFF]  19.05,6.35 0 top
U$11  [STAND-OFF]  19.05,133.35 0 top
U$12  [STAND-OFF]  273.05,133.35 0 top
U$13  [STAND-OFF]  273.05,6.35 0 top
U$14  143.51,30.48 0 top
U$15  240.03,129.54 0 top
U$17  240.03,96.52 0 top

### Tracks (layer width: path | path; a pad name or v marks a point on that pad's centre or on a via)
3.3V
  Top 0.61: R_A.P$1 27.94,74.93 U$3.8 30.61,80.01 C8.1 36.7,81.15 | 36.7,81.15 U$2.3.3V3 | 3.3V.1 36.7,73.03 36.7,81.15
+5V
  Top 0.61: U$2.VIN 60.96,130.81 46.99,130.81 39.37,123.19 39.37,106.68 38.1,105.41 C4.1 36.96,107.82 DC_5V.3 29.08,115.7 5V.1
+12V  (via drill 0.51)
  Top 0.61: U$8.24 172.72,130.81 171.45,132.08 165.1,132.08 | 165.1,132.08 157.48,132.08 | 157.48,132.08 149.86,132.08 | 149.86,132.08 142.24,132.08 | 142.24,132.08 134.62,132.08 | 134.62,132.08 127,132.08 | 127,132.08 120.65,132.08 119.38,130.81 U$8.3 | 127,132.08 U$8.6 | 134.62,132.08 U$8.9 | 142.24,132.08 U$8.12 | U$8.15 149.86,132.08 | U$8.18 157.48,132.08 | U$8.21 165.1,132.08 | U$15.3 215.9,130.81 217.17,132.08 223.52,132.08 | 223.52,132.08 231.14,132.08 | 231.14,132.08 238.76,132.08 | 238.76,132.08 246.38,132.08 | 246.38,132.08 254,132.08 | 254,132.08 261.62,132.08 | 261.62,132.08 267.97,132.08 | U$15.21 261.62,132.08 | U$15.18 254,132.08 | U$15.15 246.38,132.08 | U$15.12 238.76,132.08 | U$15.9 231.14,132.08 | U$15.6 223.52,132.08 | U$17.3 215.9,97.79 217.17,99.06 | 267.97,99.06 269.24,97.79 U$17.24 | U$17.21 261.62,99.06 | U$17.18 254,99.06 | U$17.15 246.38,99.06 | U$17.12 238.76,99.06 | U$17.9 231.14,99.06 | U$17.6 223.52,99.06 | SL1.2 215.9,64.77 217.17,66.04 | 229.87,66.04 231.14,64.77 SL1.8 | SL1.5 223.52,66.04 | U$9.3 119.38,64.77 120.65,66.04 127,66.04 | 127,66.04 134.62,66.04 | 134.62,66.04 142.24,66.04 | 142.24,66.04 149.86,66.04 | 149.86,66.04 157.48,66.04 U$9.18 | 171.45,66.04 172.72,64.77 U$9.24 172.72,62.23 154.94,44.45 101.6,44.45 IC4.10 | U$9.21 165.1,66.04 | U$9.15 149.86,66.04 | U$9.12 142.24,66.04 | U$9.9 134.62,66.04 | U$9.6 127,66.04 | U$7.3 119.38,97.79 120.65,99.06 127,99.06 | 127,99.06 134.62,99.06 | 134.62,99.06 142.24,99.06 | 142.24,99.06 149.86,99.06 U$7.15 | 171.45,99.06 172.72,97.79 U$7.24 172.72,93.98 156.21,77.47 101.6,77.47 IC3.10 | U$7.21 165.1,99.06 | U$7.18 157.48,99.06 | U$7.12 142.24,99.06 | U$7.9 134.62,99.06 | U$7.6 127,99.06
  Top 0.61: U$14.3 119.38,31.75 120.65,33.02 127,33.02 | 127,33.02 134.62,33.02 | 134.62,33.02 142.24,33.02 | 142.24,33.02 149.86,33.02 | 149.86,33.02 157.48,33.02 | 157.48,33.02 165.1,33.02 | 165.1,33.02 171.45,33.02 172.72,31.75 U$14.24 172.72,5.08 | U$14.21 165.1,33.02 | U$14.18 157.48,33.02 | U$14.15 149.86,33.02 | U$14.12 142.24,33.02 | U$14.9 134.62,33.02 | U$14.6 127,33.02 | DC_5V.1 29.34,110.36 C5.1 | J1.1 229.87,5.08 | J2.1 242.57,13.97 245.75,10.79 | IC1.10 97.79,107.95 | IC5.10 99.06,5.08 | +12V.1 36.58,10.41 36.83,10.16
  Top 1.016: 157.48,66.04 165.1,66.04 171.45,66.04 195.58,66.04 | 149.86,99.06 157.48,99.06 165.1,99.06 171.45,99.06 195.58,99.06 | C9.1 C10.1 48.26,20.45 48.26,15.24 | 195.58,99.06 217.17,99.06 223.52,99.06 231.14,99.06 238.76,99.06 246.38,99.06 254,99.06 261.62,99.06 267.97,99.06 276.86,99.06 276.86,121.92 U$15.24 269.24,130.81 267.97,132.08 120.65,132.08 v96.52,132.08 96.52,109.22 97.79,107.95 | 195.58,66.04 217.17,66.04 223.52,66.04 229.87,66.04 276.86,66.04 | IC8.10 195.58,66.04 | IC6.10 195.58,99.06
  Top 1.27: U$4.TIP 33.79,10.16 36.83,10.16 46.99,10.16 DC_+/-15V.3 | C1.1 53.34,5.08 | 53.34,5.08 C11.1 57.74,5.67 DC_+/-15V.1 | DC_+/-15V.3 48.26,15.24 78.74,15.24 88.9,5.08 99.06,5.08 172.72,5.08 195.58,5.08 | 195.58,5.08 229.87,5.08 240.03,5.08 245.75,10.79 276.86,41.91 276.86,66.04 276.86,99.06 | IC10.10 195.58,5.08 | DC_+/-15V.3 53.34,6.35 53.34,5.08
  Bottom 1.016: DC_5V.1 29.21,123.19 38.26,132.24 96.36,132.24 v96.52,132.08
+15V
  Top 1.016: DC_+/-15V.4 56.52,47.62 | 56.52,47.62 55.24,46.35 | 55.24,46.35 44.58,35.69 C9.2 27.81,24.13 8.89,24.13 | 8.89,24.13 JP4.1 | JP5.1 8.89,38.1 8.89,24.13 | JP6.1 8.89,10.16 8.89,24.13 | 55.24,46.35 | 56.52,47.62
-15V
  Bottom 1.016: JP5.3 8.89,45.1 | JP6.3 8.89,17.16 8.89,30.48 | 8.89,45.1 8.89,30.48 | DC_+/-15V.6 35.56,46.99 10.78,46.99 8.89,45.1 | JP4.3 8.24,31.13 8.89,30.48
A
  Top 0.203: JP2.1 8.89,78.74 8.89,72.39 | 8.89,72.39 JP1.1 | R_T.P$1 R_A.P$2 | U$3.6 22.86,77.47 R_A.P$2 | R_A.P$2 8.89,72.39
  Bottom 0.203: JP1.1 5.08,68.58 5.08,59.69 JP3.1
B
  Top 0.203: JP2.2 5.08,82.55 5.08,72.39 | 5.08,72.39 5.08,62.23 JP3.2 10.16,57.15 R_B.P$1 22.86,57.15 R_T.P$2 25.4,69.85 U$3.7 | JP1.2 5.08,72.39
BNC1  (via drill 0.36)
  Top 0.203: v40.03,99.06 37.08,102.01 30.48,102.01 28.14,104.34 28.14,105.97 27.43,106.68 26.72,106.68 18.19,115.21 18.19,122.22 12.14,128.27 U$6.S
  Bottom 0.203: v40.03,99.06 48.46,99.06 50.8,101.4 57,101.4 63.5,107.9 U$2.18/A4
BNC2  (via drill 0.36)
  Top 0.203: U$1.S 36.47,101.6 v38.3,99.77 | v61.57,108.51 63.5,110.44 U$2.19/A5
  Bottom 0.203: v38.3,99.77 46.23,99.77 48.26,101.8 50.8,101.8 55.88,106.88 59.94,106.88 v61.57,108.51
GND  (via drill 0.51, 0.76)
  other vias: 86.36,60.96 55.88,64.14
  pour Bottom: 0,139.7 284.76,142.09 279.46,-0.19 0,0
  pour Top (rank 2): 0,139.7 279.27,140.21 284.19,-2.68 0,0
N$2
  Top 0.61: IC1.18 115.57,128.27 U$8.2
N$3
  Top 0.61: U$8.5 124.46,128.27 121.92,125.73 IC1.17
N$4
  Top 0.61: U$8.8 132.08,128.27 127,123.19 IC1.16
N$5
  Top 0.61: U$8.11 139.7,128.27 132.08,120.65 IC1.15
N$6
  Top 0.61: U$8.14 147.32,128.27 137.16,118.11 IC1.14
N$7
  Top 0.61: U$8.17 154.94,128.27 142.24,115.57 IC1.13
N$8
  Top 0.61: U$8.20 162.56,128.27 147.32,113.03 IC1.12
N$9
  Top 0.61: U$8.23 170.18,128.27 152.4,110.49 IC1.11
N$17
  Top 0.61: U$7.23 170.18,95.25 153.67,78.74 100.33,78.74 IC3.11
N$18
  Top 0.61: U$7.20 162.56,95.25 147.32,80.01 IC3.12
N$19
  Top 0.61: U$7.17 154.94,95.25 142.24,82.55 IC3.13
N$20
  Top 0.61: U$7.14 147.32,95.25 137.16,85.09 IC3.14
N$21
  Top 0.61: U$7.11 139.7,95.25 132.08,87.63 IC3.15
N$22
  Top 0.61: U$7.8 132.08,95.25 127,90.17 IC3.16
N$23
  Top 0.61: U$7.5 124.46,95.25 121.92,92.71 IC3.17
N$24
  Top 0.61: IC3.18 115.57,95.25 U$7.2
N$25
  Top 0.61: U$9.23 170.18,62.23 153.67,45.72 100.33,45.72 IC4.11
N$26
  Top 0.61: U$9.20 162.56,62.23 147.32,46.99 IC4.12
N$27
  Top 0.61: U$9.17 154.94,62.23 142.24,49.53 IC4.13
N$28
  Top 0.61: U$9.14 147.32,62.23 137.16,52.07 IC4.14
N$29
  Top 0.61: U$9.11 139.7,62.23 132.08,54.61 IC4.15
N$30
  Top 0.61: U$9.8 132.08,62.23 127,57.15 IC4.16
N$31
  Top 0.61: U$9.5 124.46,62.23 121.92,59.69 IC4.17
N$32
  Top 0.61: IC4.18 115.57,62.23 U$9.2
N$33
  Top 0.61: U$14.23 170.18,29.21 152.4,11.43 IC5.11
N$34
  Top 0.61: U$14.20 162.56,29.21 147.32,13.97 IC5.12
N$35
  Top 0.61: U$14.17 154.94,29.21 142.24,16.51 IC5.13
N$36
  Top 0.61: U$14.14 147.32,29.21 137.16,19.05 IC5.14
N$37
  Top 0.61: U$14.11 139.7,29.21 132.08,21.59 IC5.15
N$38
  Top 0.61: U$14.8 132.08,29.21 127,24.13 IC5.16
N$39
  Top 0.61: U$14.5 124.46,29.21 121.92,26.67 IC5.17
N$40
  Top 0.61: IC5.18 115.57,29.21 U$14.2
N$51
  Top 0.61: U$15.23 266.7,128.27 248.92,110.49 IC6.11
N$52
  Top 0.61: U$15.20 259.08,128.27 243.84,113.03 IC6.12
N$61
  Top 0.61: U$15.17 251.46,128.27 238.76,115.57 IC6.13
N$63
  Top 0.61: U$15.14 243.84,128.27 233.68,118.11 IC6.14
N$64
  Top 0.61: U$15.11 236.22,128.27 228.6,120.65 IC6.15
N$65
  Top 0.61: U$15.8 228.6,128.27 223.52,123.19 IC6.16
N$66
  Top 0.61: U$15.5 220.98,128.27 218.44,125.73 IC6.17
N$67
  Top 0.61: IC6.18 212.09,128.27 U$15.2
N$76
  Top 0.61: U$17.23 266.7,95.25 248.92,77.47 IC8.11
N$77
  Top 0.61: U$17.20 259.08,95.25 243.84,80.01 IC8.12
N$78
  Top 0.61: U$17.17 251.46,95.25 238.76,82.55 IC8.13
N$79
  Top 0.61: U$17.14 243.84,95.25 233.68,85.09 IC8.14
N$80
  Top 0.61: U$17.11 236.22,95.25 228.6,87.63 IC8.15
N$81
  Top 0.61: U$17.8 228.6,95.25 223.52,90.17 IC8.16
N$82
  Top 0.61: U$17.5 220.98,95.25 218.44,92.71 IC8.17
N$83
  Top 0.61: IC8.18 212.09,95.25 U$17.2
N$92
  Top 0.61: J2.2 245.11,17.78 218.44,44.45 IC10.11
N$93
  Bottom 0.61: J1.2 232.41,20.32 205.74,46.99 IC10.12
N$97
  Top 0.61: IC10.16 223.52,57.15 228.6,62.23 SL1.7
N$98
  Top 0.61: IC10.17 218.44,59.69 220.98,62.23 SL1.4
N$99
  Top 0.61: IC10.18 212.09,62.23 SL1.1
RTS
  Top 0.406: U$3.2 U$3.3
RX
  Bottom 0.203: U$2.0 48.26,124.66 35.56,111.96 35.56,95.3 27.94,87.68 U$3.1
TX
  Top 0.203: U$2.1 48.26,122.12 40.74,114.61 40.74,98.75 30.79,88.8 21.44,88.8 20.32,87.68 U$3.4
V01
  Bottom 0.203: IC1.1 91.44,128.22 67.46,128.22 63.6,124.36 51.92,124.36 48.26,120.7 U$2.2
V02  (via drill 0.36)
  Top 0.203: v87.17,121.41 91.44,125.68 IC1.2
  Bottom 0.203: v87.17,121.41 68.28,121.41 63.91,117.04 53.14,117.04 51.51,115.42 49.58,115.42 48.67,114.5 47.85,114.5 47.14,115.21 47.14,116.94 48.26,118.06 U$2.3
V03
  Bottom 0.203: IC1.3 91.44,123.14 67.46,123.14 63.5,119.18 52.73,119.18 51.51,117.96 50.6,117.96 48.26,115.62 U$2.4
V04
  Top 0.203: IC1.4 91.44,120.7 67.56,120.7 63.91,124.36 52.32,124.36 49.38,121.41 49.38,114.2 48.26,113.08 U$2.5
V05
  Bottom 0.203: IC1.5 91.44,118.06 65.53,118.06 64.11,116.64 57.81,116.64 51.71,110.54 48.26,110.54 U$2.6
V06
  Bottom 0.203: IC1.6 91.44,115.52 64.92,115.52 63.5,114.1 60.96,114.1 58.83,111.96 53.75,111.96 49.78,108 48.26,108 U$2.7
V07
  Bottom 0.203: IC1.7 91.44,112.98 64.92,112.98 63.5,111.56 54.36,111.56 48.26,105.46 U$2.8
V08
  Bottom 0.203: IC1.8 91.44,110.44 64.92,110.44 63.7,109.22 54.56,109.22 48.26,102.92 U$2.9
V09  (via drill 0.36)
  Top 0.203: v50.8,100.38 48.26,100.38 U$2.10
  Bottom 0.203: v50.8,100.38 56.59,100.38 60.15,103.94 81.18,103.94 89.81,95.3 91.44,95.3 IC3.1
V10
  Bottom 0.203: IC3.2 91.44,92.76 72.54,92.76 63.91,101.4 58.22,101.4 54.66,97.84 48.26,97.84 U$2.11
V11
  Bottom 0.203: IC3.3 91.44,90.22 72.54,90.22 63.91,98.86 56.29,98.86 52.73,95.3 48.26,95.3 U$2.12
V12
  Top 0.203: IC3.4 91.44,87.68 71.02,87.68 63.5,95.2 U$2.13
V13
  Bottom 0.203: IC3.5 91.44,85.14 76.1,85.14 63.5,97.74 U$2.14/A0
V14
  Bottom 0.203: IC3.6 91.44,83.11 92.96,84.63 92.96,90.63 91.85,91.75 72.03,91.75 63.5,100.28 U$2.15/A1
V15
  Top 0.203: IC3.7 91.44,80.06 64.92,80.06 63.5,81.48 63.09,81.48 62.08,82.5 62.08,85.95 61.98,86.06 61.98,101.3 63.5,102.82 U$2.16/A2
V16
  Bottom 0.203: IC3.8 91.44,78.03 89.92,79.55 89.92,80.47 91.03,81.58 92.46,81.58 93.37,82.5 93.37,95.3 83.31,105.36 63.5,105.36 U$2.17/A3
V17
  Bottom 0.203: IC4.1 91.44,72.34 95.1,76 95.1,111.35 92.46,114 64.41,114 63.5,113.08 U$2.20/A6
V18
  Bottom 0.203: IC4.2 91.44,60.25 95.5,64.31 95.5,113.49 92.46,116.53 64.62,116.53 63.7,115.62 63.5,115.62 U$2.21/A7
V19  (via drill 0.36)
  Top 0.203: v94.39,81.48 94.39,89.2 91.85,91.75 89.81,91.75 63.5,118.06 U$2.22/A8
  Bottom 0.203: IC4.3 91.44,57.71 89.92,59.23 89.92,71.42 94.39,75.89 v94.39,81.48
V20
  Bottom 0.203: IC4.4 91.44,55.17 95.91,59.64 95.91,120.7 92.46,124.16 66.95,124.16 63.5,120.7 U$2.23/A9
V21
  Bottom 0.203: IC4.5 91.44,52.12 90.32,53.24 90.22,53.24 72.75,70.71 72.75,73.46 69.8,76.4 63.09,76.4 59.54,79.96 59.54,80.37 58.42,81.48 58.01,81.48 57,82.5 57,82.91 55.88,84.02 54.36,84.02 48.26,90.12 U$2.24
V22  (via drill 0.36)
  Top 0.203: v61.27,59.74 61.27,60.86 49.78,72.34 49.78,79.96 48.26,81.48 47.85,81.48 47.14,82.19 47.14,86.46 48.26,87.58 U$2.25
  Bottom 0.203: IC4.6 91.44,48.97 92.96,47.45 92.96,43.99 92.46,43.48 77.52,43.48 v61.27,59.74
V23
  Bottom 0.203: IC4.7 91.44,47.04 87.78,47.04 63.5,71.32 55.47,71.32 49.38,77.42 49.38,83.92 48.26,85.04 U$2.26
V24  (via drill 0.36)
  Top 0.203: v61.27,64.11 58.62,64.11 50.19,72.54 50.19,80.57 48.26,82.5 U$2.27
  Bottom 0.203: v61.27,64.11 80.87,44.5 91.44,44.5 IC4.8
V25  (via drill 0.36)
  Top 0.203: IC5.1 91.44,28.65 92.96,27.13 92.96,26.21 92.46,25.7 v85.85,25.7
  Bottom 0.203: v85.85,25.7 83.82,25.7 46.74,62.79 46.74,78.44 48.26,79.96 U$2.28
V26  (via drill 0.36)
  Top 0.203: v68.68,48.67 90.63,26.72 91.44,26.72 IC5.2
  Bottom 0.203: v68.68,48.67 68.68,49.07 49.38,68.38 49.38,70.21 48.26,71.32 47.85,71.32 47.14,72.03 47.14,76.3 48.26,77.42 U$2.29
V27  (via drill 0.36)
  Top 0.203: v61.27,58.73 60.33,59.66 60.33,60.96 49.38,71.88 49.38,73.76 48.26,74.88 U$2.30
  Bottom 0.203: IC5.3 91.44,24.69 70.92,45.21 70.92,49.07 v61.27,58.73
V28
  Bottom 0.203: IC5.4 91.44,21.03 92.96,19.51 92.96,16.05 92.46,15.54 90.42,15.54 86.56,19.41 86.56,28.35 69.39,45.52 69.39,48.97 49.78,68.58 49.78,70.81 48.26,72.34 U$2.31/A12
V29  (via drill 0.36)
  Top 0.203: v68.68,41.86 91.44,19.1 IC5.5
  Bottom 0.203: v68.68,41.86 68.68,47.55 48.26,67.97 U$2.32/A13
V30
  Bottom 0.203: IC5.6 91.44,17.07 86.97,21.54 86.97,28.55 70.51,45.01 70.51,48.46 60.55,58.42 60.55,66.85 63.5,69.8 U$2.33/A14
V31
  Top 0.203: IC5.7 91.44,14.53 67.97,38 67.97,60.86 63.3,65.53 63.3,68.17 64.62,69.49 64.62,71.22 63.5,72.34 U$2.34/A15
V32
  Top 0.203: IC5.8 91.44,11.99 67.56,35.87 67.56,58.42 62.38,63.6 62.38,73.76 63.5,74.88 U$2.35/A16
V33  (via drill 0.36)
  Top 0.203: v97.43,79.05 94.39,79.05 91.85,81.58 64.41,81.58 63.5,82.5 U$2.38/A19
  Bottom 0.203: IC6.1 187.96,127.71 179.22,118.97 179.22,104.34 176.58,101.7 176.58,96.01 166.42,85.85 106.88,85.85 100.08,79.05 v97.43,79.05
V34  (via drill 0.36)
  Top 0.203: v80.06,104.65 147.42,104.65 168.45,125.68 187.96,125.68 IC6.2 | v71.83,104.65 63.5,96.32 63.09,96.32 62.38,95.61 62.38,86.26 63.5,85.14 U$2.39/A20
  Bottom 0.203: v71.83,104.65 v80.06,104.65
V35  (via drill 0.36)
  Top 0.203: IC6.3 187.96,122.63 189.48,121.11 189.48,117.65 188.37,116.53 160.53,116.53 147.22,103.23 v80.87,103.23 | v61.77,102.11 61.77,101.7 55.88,95.81 U$2.40
  Bottom 0.203: v80.87,103.23 65.33,103.23 63.91,101.8 62.08,101.8 v61.77,102.11
V36  (via drill 0.36)
  Top 0.203: IC6.4 187.96,121.21 186.44,122.73 186.44,123.65 186.94,124.16 188.98,124.16 189.89,123.24 189.89,115.52 188.37,114 158.6,114 144.37,99.77 101.4,99.77 v94.39,92.76
  Bottom 0.203: v94.39,92.76 94.39,82.5 92.96,81.08 92.96,77.01 92.46,76.5 78.64,76.5 63.91,91.24 58.01,91.24 57,90.22 57,88.8 55.88,87.68 U$2.41
V37
  Top 0.203: IC6.5 187.96,118.06 161.44,118.06 147.32,103.94 79.76,103.94 64.11,119.58 60.96,119.58 54.36,112.98 54.36,86.67 55.88,85.14 U$2.42
V38
  Bottom 0.203: IC6.6 187.96,116.13 189.48,117.65 189.48,128.73 188.98,129.24 176.78,129.24 172.11,124.56 66.45,124.56 63.6,121.72 52.73,121.72 51.51,120.5 49.58,120.5 48.26,119.18 47.85,119.18 37.59,108.92 37.59,96.83 48.26,86.16 48.67,86.16 52.22,82.6 52.22,82.09 54.25,80.06 55.88,80.06 U$2.43
V39  (via drill 0.36)
  Top 0.203: v177.29,96.72 156.87,76.3 103.43,76.3 100.69,73.56 72.64,73.56 v67.67,78.54 | v61.27,77.22 v62.28,78.23
  Bottom 0.203: IC6.7 187.96,112.47 177.29,101.8 v177.29,96.72 | v67.67,78.54 62.59,78.54 v62.28,78.23 | v61.27,77.22 59.64,77.22 58.83,76.4 56.9,76.4 55.88,77.42 U$2.44
V40  (via drill 0.36)
  Top 0.203: v156.06,110.44 187.96,110.44 IC6.8 | v96.72,66.14 71.42,66.14 71.12,65.84 v64.01,65.84 | v61.67,66.95 61.67,70.61 58.42,73.86 56.9,73.86 55.88,74.88 U$2.45
  Bottom 0.203: v156.06,110.44 128.93,110.44 99.47,80.97 98.04,80.97 96.72,79.65 v96.72,66.14 | v64.01,65.84 62.79,65.84 v61.67,66.95
V41  (via drill 0.36)
  Top 0.203: IC8.1 187.96,94.69 189.48,93.17 189.48,77.01 188.77,76.3 159.92,76.3 150.47,66.85 85.95,66.85 85.65,66.55 v70.81,66.55
  Bottom 0.203: v70.81,66.55 63.91,73.46 56.9,73.46 55.88,72.44 U$2.46
V42  (via drill 0.36)
  Top 0.203: v88.19,69.09 150.27,69.09 173.84,92.66 187.96,92.66 IC8.2 | v64.72,65.13 v84.23,65.13 | v61.67,65.94 59.54,68.07 59.54,71.22 58.42,72.34 U$2.47
  Bottom 0.203: v84.23,65.13 v88.19,69.09 | v64.72,65.13 62.48,65.13 v61.67,65.94
V43  (via drill 0.51)
  Top 0.254: v189.89,72.39 v189.89,68.58
  Bottom 0.203: IC8.3 187.96,89.61 189.89,87.68 v189.89,72.39 | v189.89,68.58 189.89,44.4 188.98,43.48 104.55,43.48 99.47,48.56 94.39,48.56 92.25,50.7 87.68,50.7 64.52,73.86 59.44,73.86 58.42,74.88 U$2.48
V44  (via drill 0.36)
  Top 0.203: v71.73,76.5 v97.43,76.5
  Bottom 0.203: v97.43,76.5 100.08,76.5 109.02,85.45 166.62,85.45 168.76,87.58 187.96,87.58 IC8.4 | v71.73,76.5 71.02,76.5 63.5,84.02 60.96,84.02 58.42,86.56 53.34,86.56 48.67,91.24 47.85,91.24 47.14,90.53 47.14,89.81 48.26,88.7 48.77,88.7 54.76,82.7 54.76,82.19 55.88,81.08 56.29,81.08 57.3,80.06 57.3,78.64 58.42,77.52 U$2.49
V45  (via drill 0.36)
  Top 0.203: v100.99,74.88 100.08,73.97 73.25,73.97 67.97,79.25 v64.82,79.25 | v61.57,78.94 59.44,78.94 58.42,79.96 U$2.50
  Bottom 0.203: v100.99,74.88 111.15,85.04 187.96,85.04 IC8.5 | v64.82,79.25 64.21,79.25 63.91,78.94 v61.57,78.94
V46
  Top 0.203: IC8.6 187.96,82.5 164.29,82.5 150.16,68.38 71.53,68.38 63.5,76.4 60.96,76.4 58.42,78.94 58.01,78.94 57.3,79.65 57.3,83.92 58.42,85.04 U$2.51
V47  (via drill 0.36)
  Top 0.203: v82.4,67.67 82.7,67.97 150.37,67.97 162.36,79.96 187.96,79.96 IC8.7
  Bottom 0.203: v82.4,67.67 63.5,86.56 59.44,86.56 58.42,87.58 U$2.52
V48  (via drill 0.36)
  Top 0.203: v85.34,67.26 150.27,67.26 160.43,77.42 187.96,77.42 IC8.8
  Bottom 0.203: v85.34,67.26 63.5,89.1 59.44,89.1 58.42,90.12 U$2.53
V49  (via drill 0.36)
  Top 0.203: v110.64,83.52 98.65,83.52 94.79,87.38 94.79,91.34 91.85,94.28 88.8,94.28 63.91,119.18 63.09,119.18 62.08,118.16 62.08,115.21 58.42,111.56 58.01,111.56 57.3,110.85 57.3,106.58 58.42,105.46 U$2.54
  Bottom 0.203: v110.64,83.52 157.68,83.52 178.92,62.28 187.96,62.28 IC10.1
V50  (via drill 0.36)
  Top 0.203: v97.43,69.8 72.64,69.8 63.5,78.94 63.09,78.94 59.54,82.5 59.54,85.45 58.42,86.56 58.01,86.56 57,87.58 57,87.99 55.88,89.1 55.47,89.1 54.76,89.81 54.76,100.28 59.54,105.05 59.54,106.78 58.42,107.9 U$2.55
  Bottom 0.203: IC10.2 187.96,59.13 189.48,57.61 189.48,56.69 188.98,56.19 111.05,56.19 v97.43,69.8
V51  (via drill 0.36)
  Top 0.203: v108.1,80.97 94.89,80.97 94.69,80.77 94.08,80.77 92.96,81.89 92.96,88.09 91.85,89.2 88.29,89.2 70.61,106.88 61.98,106.88 58.42,110.44 U$2.56
  Bottom 0.203: v108.1,80.97 159.61,80.97 183.39,57.2 187.96,57.2 IC10.3
V-3WAY-1
  Bottom 0.203: IC10.7 187.96,47.04 106.07,47.04 99.47,53.65 90.42,53.65 73.15,70.92 73.15,73.66 69.39,77.42 63.5,77.42 U$2.36/A17
V-3WAY-2  (via drill 0.36)
  Top 0.203: v72.03,73.15 71.63,73.15 66.24,78.54 64.52,78.54 63.5,79.55 U$2.37/A18
  Bottom 0.203: v72.03,73.15 72.03,69.49 90.42,51.1 99.47,51.1 106.07,44.5 187.96,44.5 IC10.8

### Text on the board
tPlace: G | B | A | G | B | A | G | B | A | - | C | + | +/-15V | - | C | + | - | C | +
tNames: 1 | 8 | 33 | 40 | VX7805-500 | 9 | 16 | 41 | 48 | MFC Comm | MFC Power | 17 | 24 | 49 | 51 | JTL6024D15 | ODB | 25 | 32 | The Olfactory Delivery Board v2.0 / July 2018, OM | AV1 | AV2 | Aux Valves